# Altium schematic sheet USB_UART.SchDoc: USB to UART
size A; CompanyName: CUInSpace; DrawnBy: Matteo Golin; Engineer: Matteo Golin; Organization: CUInSpace; Revision: B; SheetNumber: 2; SheetTotal: 4
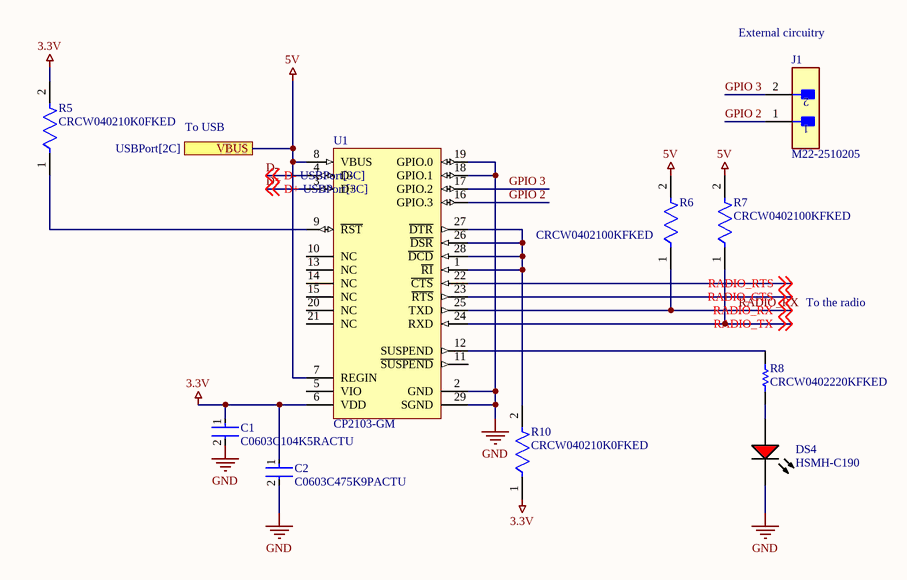
[diagram p0: USB_UART.SchDoc]

## Parts
C1  C0603C104K5RACTU  [FP-C0603C-CF-MFG]
C2  C0603C475K9PACTU  [FP-C0603-CG-MFG]
DS4  HSMH-C190  [AVAG-HSMX-C190_V]
J1  M22-2510205  [FP-M22-2510205-MFG]
R5  CRCW040210K0FKED  [FP-CRCW0402-e3-IPC_B]
R6  CRCW0402100KFKED  [FP-CRCW0402-e3-IPC_C]
R7  CRCW0402100KFKED  [FP-CRCW0402-e3-IPC_C]
R8  CRCW0402220KFKED  [RESC1005X40X25LL05T05]
R10  CRCW040210K0FKED  [FP-CRCW0402-e3-IPC_B]
U1  CP2103-GM  [SLAB-QFN-28-3125x3125TP_A_M]

## Ports
VBUS (see USBPort[2C])

## Nets
3.3V: C1.1 C2.1 R5.2 R10.1 U1.6(VDD)
5V: R6.2 R7.2 U1.7(REGIN) U1.8(VBUS) ; port VBUS
GND: C1.2 C2.2 DS4.2(K) U1.2(GND) U1.18(GPIO.1) U1.19(GPIO.0) U1.29(SGND)
D+: U1.3(D+) ; off-sheet D+
D-: U1.4(D-) ; off-sheet D-
GPIO 2: J1.1 U1.16(GPIO.3)
GPIO 3: J1.2 U1.17(GPIO.2)
RADIO_CTS: U1.23(~{RTS}) ; off-sheet RADIO_CTS
RADIO_RTS: U1.22(~{CTS}) ; off-sheet RADIO_RTS
RADIO_RX: R6.1 U1.25(TXD) ; off-sheet RADIO_RX
RADIO_TX: R7.1 U1.24(RXD) ; off-sheet RADIO_TX
NetDS4_1: DS4.1(A) R8.1
NetR5_1: R5.1 U1.9(~{RST})
NetR8_2: R8.2 U1.12(SUSPEND)
NetR10_2: R10.2 U1.1(~{RI}) U1.26(~{DSR}) U1.27(~{DTR}) U1.28(~{DCD})

Not connected (* = marked no-connect by the designer): U1 5(VIO) 10(NC) 11(~{SUSPEND}) 13(NC) 14(NC) 15(NC) 20(NC) 21(NC)

## Notes on the sheet
- External circuitry
- To USB
- To the radio

## Library data of the parts
C1 = CMP-2006-03061-2: CAP CER 0.1UF 50V X7R 0603; Manufacturer: KEMET; Tolerance: 0.1; Temperature Coefficient: 30ppm/°C; Material: Ceramic; Automotive Grade: Grade 1; Value: 0.10 μF; Temperature: -55°C to +125°C; RoHS: TRUE; Temperature Range High: +125°C; Lead Free: Yes; Octopart: https://octopart.com/c0603c104k5ractu-kemet-139244; Digikey Description: CAP CER 0.1UF 50V X7R 0603; Category: Cap; Package: C0603C-CF; ComponentLink2Description: Datasheet; Temperature Range Low: -55°C; Device Class L1: Passive Components; Voltage Rating: 50 V; Automotive: Yes; Device Class L3: Ceramic Capacitors; ComponentLink2URL: https://api.kemet.com/component-edge/download/datasheet/C0603C100J5GACAUTO.pdf; Capacitance: 0.10 μF; Device Class L2: Capacitors; Manufacturer Part Number: C0603C104K5RACTU; Temperature Characteristic: X7R; Height: 0.87mm
C2 = CMP-2006-02256-2: CAP CER 4.7UF 6.3V X5R 0603; Manufacturer: Kemet; Temperature Coefficient: 15%; Tolerance: 10%; Material: Ceramic; Device Class L3: Ceramic Capacitors; RoHS: TRUE; Value: 4.7uF; Lead Free: Yes; ComponentLink2Description: Datasheet; Mouser Description: Multilayer Ceramic Capacitors MLCC - SMD/SMT 6.3volts 4.7uF X5R 10%; Package: C0603-CG; Digikey Description: CAP CER 4.7UF 6.3V X5R 0603; ComponentLink2URL: https://content.kemet.com/datasheets/KEM_C1006_X5R_SMD.pdf; Category: Cap; Temperature Range Low: -55°C; Capacitance: 4.7uF; Temperature: -55°C to +85°C; Octopart: https://octopart.com/c0603c475k9pactu-kemet-104242; Ipc Land Pattern Name: CAPC16080X80; Voltage Rating: 6.3V; Temperature Range High: +85°C; Height: 0.9mm; Temperature Characteristic: X5R; Device Class L1: Passive Components; Manufacturer Part Number: C0603C475K9PACTU; Automotive: No; Device Class L2: Capacitors
DS4 = CMP-1744-00004-1: LED Uni-Color Red, 65 mW, 20 mA, -40 to 85 degC, 2-Pin SMD, RoHS, Tape and Reel; Connector Type: USB; Gender: Male; Current Rating: 1 A; Length: 7.5 mm; Lead Pitch: 0.65 mm; PackageReference: HSMX-C190; Package Quantity: 2000; Max Operating Temperature: 85 degC; PackageDescription: 2-Pin Surface Mount Device, Body 1.6 x 0.8 mm, Height 0.9 mm; ComponentLink3Description: Package Specification; Mount: Surface Mount; Min Operating Temperature: -30 degC; ComponentLink3URL: http://www.fairchildsemi.com/dwg/MA/MA03D.pdf; ComponentLink1Description: Manufacturer URL; Contact Material: Copper; Pins: 5; Width: 5.6 mm; ComponentLink2Description: Datasheet; RoHSCompliant: true; DatasheetVersion: Mar-12; Height: 2.8 mm; Packaging: Tape and Reel; Contact Plating: Gold; ComponentLink1URL: http://www.avagotech.com/; REACH SVHC: No SVHC; ComponentLink2URL: http://docs.avagotech.com/docs/AV02-0551EN
J1 = CMP-15831-000005-1: CONN HEADER VERT 2POS 2MM; Manufacturer: Harwin; Conn Gender: Male; Current Rating: 2A; Number Of Contacts: 2; Conn Orientation: Vertical; Temperature Range Low: -40°C; Device Class L1: Connectors; ComponentLink2URL: https://cdn.harwin.com/pdfs/C018XX_M22_Series_Connectors.pdf; Temperature Range High: +105°C; Pitch: 2mm; Number Of Rows: 1; Temperature: -40°C to +105°C; Automotive: No; Device Class L3: unset; Octopart: https://octopart.com/m22-2510205-harwin-2538221; Mouser Description: Headers & Wire Housings 2 PIN SIL VERTICAL GOLD PIN HEADER; Height: 5.45mm; Category: Conn; Digikey Description: CONN HEADER VERT 2POS 2MM; Contact Material: Gold,Nickel; Lead Free: Yes; ComponentLink2Description: Datasheet; Manufacturer Part Number: M22-2510205; Device Class L2: Headers and Wire Housings; Package: 0; Footprint Url: https://cdn.harwin.com/pdfs/M22-251.pdf; RoHS: TRUE
R5 R10 = CMP-2002-08135-2: RES SMD 10K OHM 1% 1/16W 0402; Power Rating: 63mW; Resistance: 10kR; Voltage Rating: 50V; Temperature Coefficient: 100ppm/°C; Case Code (Metric): 1005; Features: Automotive AEC-Q200; Termination: SMD/SMT; Mount: Surface Mount; Package Quantity: 10; Packaging: Tape and Reel; Case Code (Imperial): 0402; Weight: 2.3E-05oz; Lead Free: Lead Free; Width: 0.02inch; Max Power Dissipation: 63mW; Tolerance: 1%; Number of Terminations: 2; Height: 0.35mm; Number of Pins: 2; Composition: Thick Film; Length: 1mm; Voltage Rating (DC): 50V; Case/Package: 0402; Radiation Hardening: No; Contact Plating: Tin; Depth: 0.5mm; Military Standard: Not; Min Operating Temperature: -55°C; Max Operating Temperature: 155°C
R6 R7 = CMP-2002-08123-3: RES Thick Film, 100kΩ, 1%, 0.063W, 100ppm/°C, 0402; Power Rating: 63mW; Resistance: 100kR; Voltage Rating (DC): 50V; Lead Free: Lead Free; Height: 0.35mm; Contact Plating: Tin; Min Operating Temperature: -55°C; Package Quantity: 10000; Case/Package: 0402; Temperature Coefficient: 100ppm/°C; Number of Terminations: 2; Packaging: Tape and Reel; Max Power Dissipation: 63mW; Case Code (Metric): 1005; Mount: Surface Mount; Width: 0.02inch; Termination: SMD/SMT; Length: 1mm; Number of Pins: 2; Weight: 2.3E-05oz; Radiation Hardening: No; Tolerance: 1%; Military Standard: Not; Features: Automotive AEC-Q200; Depth: 0.5mm; Composition: Thick Film; Max Operating Temperature: 155°C; Voltage Rating: 50V; Case Code (Imperial): 0402
R8 = CMP-2002-08370-1: Manufacturer: Vishay Dale; Part Number: CRCW0402220KFKED
U1 = CMP-0511-00006-1: Single-Chip USB to UART Bridge, 1024 Bytes EEPROM, -40 to 85 degC, 28-pin QFN, Tube; Manufacturer: Silicon Labs; Internal Oscillator: TRUE; Sub-Family: USB Bridges; PackageDescription: 28-Pin Quad-Flat No-Leads Package, Body 5 x 5 mm, Pitch 0.5 mm; PartNumber: CP2103-GM; ComponentLink2Description: Datasheet; ComponentLink2URL: http://www.silabs.com/Support%20Documents/TechnicalDocs/CP2103.pdf; ComponentLink1URL: http://www.silabs.com/; Mounting Technology: Surface Mount; ComponentLink1Description: Manufacturer URL; PackageReference: QFN-28; EEPROM: 1024 Bytes; DatasheetVersion: Rev. 1.0; ComponentLink3Description: Package Specification; ComponentLink3URL: http://www.silabs.com/Support%20Documents/TechnicalDocs/C8051F35x.pdf